# EAGLE design Street_Fighter_v1.4 (EAGLE 7.5.0)
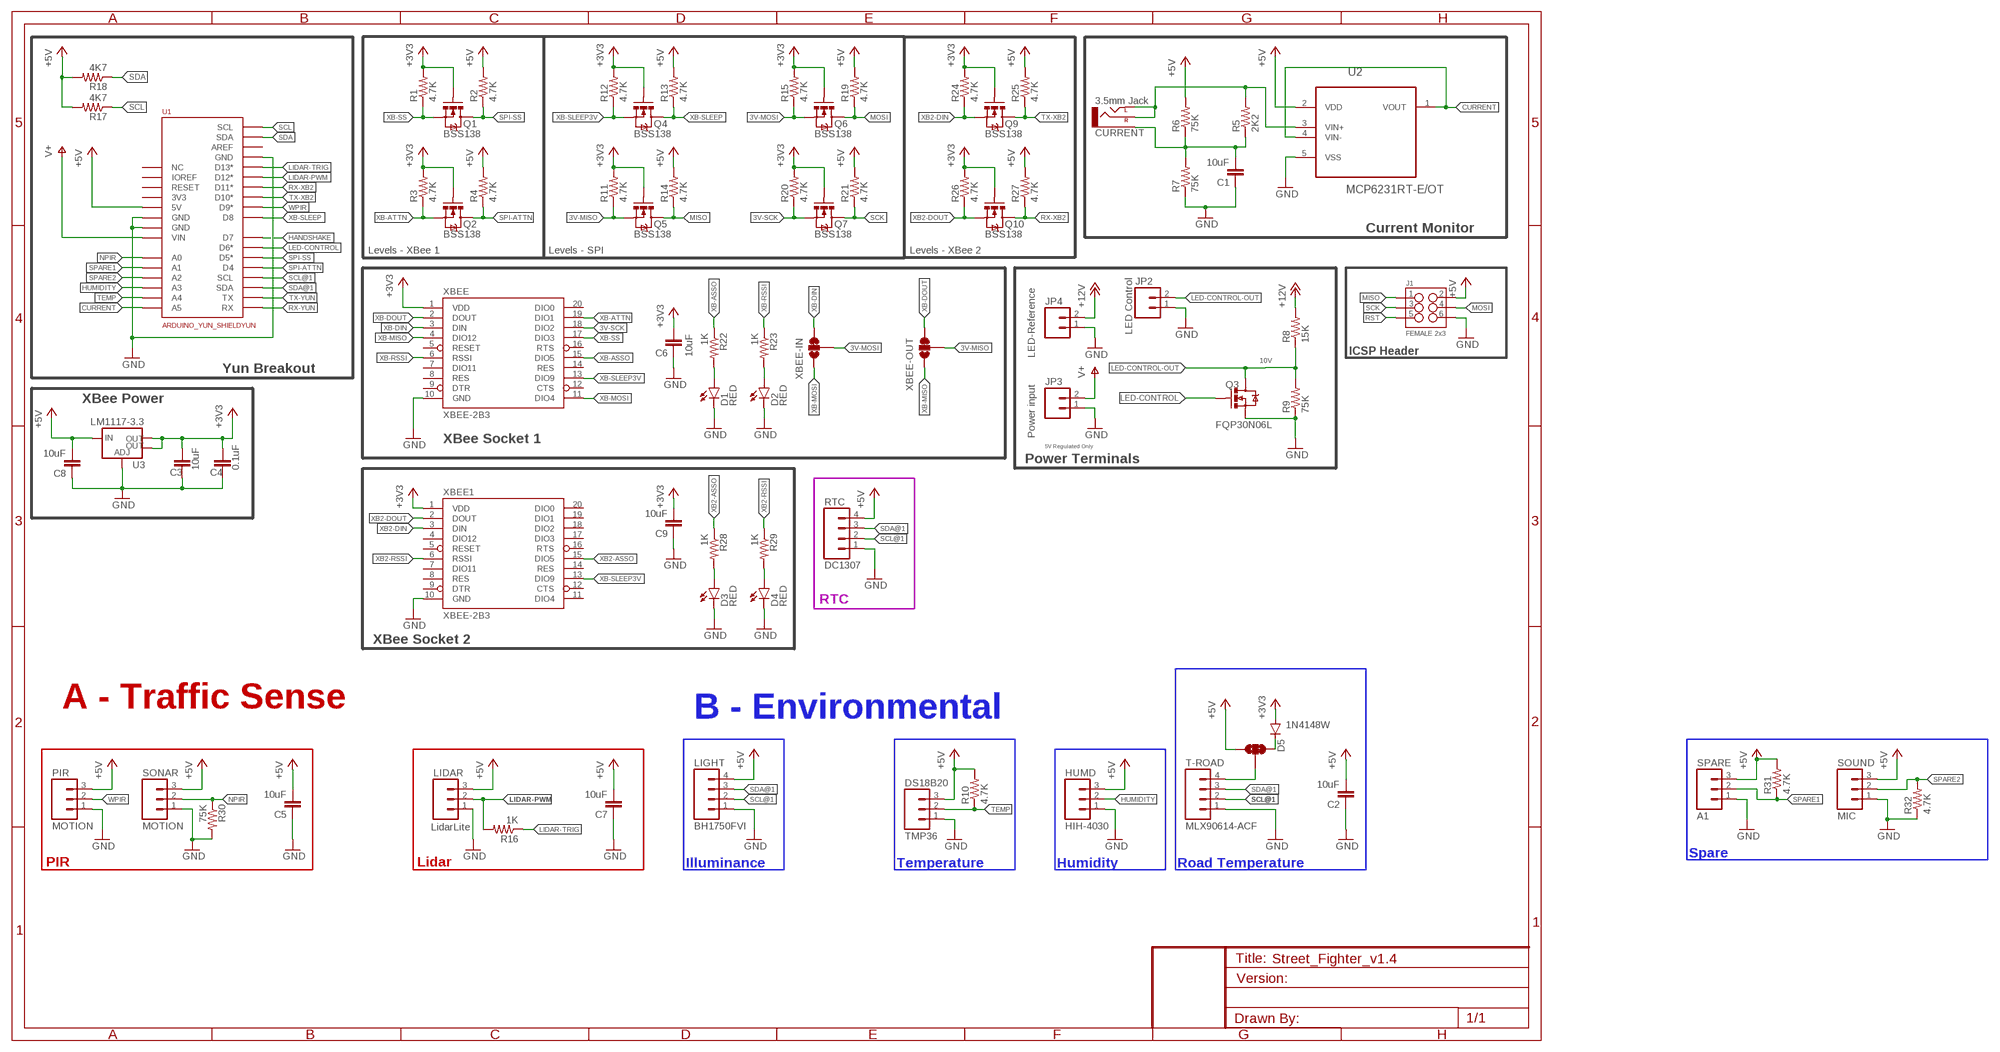
[diagram p0: schematic, sheet 1]

## Parts
C1  10uF  10UF-6.3V-20%(1206)  [1206]
C2  10uF  10UF-6.3V-20%(1206)  [1206]
C3  10uF  10UF-6.3V-20%(1206)  [1206]
C4  0.1uF  10UF-6.3V-20%(1206)  [1206]
C5  10uF  10UF-6.3V-20%(1206)  [1206]
C6  10uF  10UF-6.3V-20%(1206)  [1206]
C7  10uF  10UF-6.3V-20%(1206)  [1206]
C8  10uF  10UF-6.3V-20%(1206)  [1206]
C9  10uF  10UF-6.3V-20%(1206)  [1206]
CURRENT  3.5mm Jack  AUDIO-JACKPTH  [AUDIO-JACK]
D1  RED  LED-RED1206  [LED-1206]
D2  RED  LED-RED1206  [LED-1206]
D3  RED  LED-RED1206  [LED-1206]
D4  RED  LED-RED1206  [LED-1206]
D5  1N4148W  DIODESOD123  [SOD-123]
DS18B20  TMP36  M03PTH  [1X03]
HUMD  HIH-4030  M03PTH  [1X03]
J1  FEMALE 2x3  M03X2FEMALE  [2X3]
JP2  LED Control  M02PTH3  [1X02_LONGPADS]
JP3  Power input  M02PTH3  [1X02_LONGPADS]
JP4  LED-Reference  M02PTH3  [1X02_LONGPADS]
LIDAR  LidarLite  M03PTH  [1X03]
LIGHT  BH1750FVI  M04PTH  [1X04]
PIR  MOTION  M03PTH  [1X03]
Q1  BSS138  MOSFET-NCHANNELBSS123LT1G  [SOT23]
Q2  BSS138  MOSFET-NCHANNELBSS123LT1G  [SOT23]
Q3  FQP30N06L  MOSFET-NCHANNELFQP30N06L  [TO220V]
Q4  BSS138  MOSFET-NCHANNELBSS123LT1G  [SOT23]
Q5  BSS138  MOSFET-NCHANNELBSS123LT1G  [SOT23]
Q6  BSS138  MOSFET-NCHANNELBSS123LT1G  [SOT23]
Q7  BSS138  MOSFET-NCHANNELBSS123LT1G  [SOT23]
Q9  BSS138  MOSFET-NCHANNELBSS123LT1G  [SOT23]
Q10  BSS138  MOSFET-NCHANNELBSS123LT1G  [SOT23]
R1  4.7K  RESISTOR1206  [1206]
R2  4.7K  RESISTOR1206  [1206]
R3  4.7K  RESISTOR1206  [1206]
R4  4.7K  RESISTOR1206  [1206]
R5  2K2  RESISTOR1206  [1206]
R6  75K  RESISTOR1206  [1206]
R7  75K  RESISTOR1206  [1206]
R8  15K  RESISTOR1206  [1206]
R9  75K  RESISTOR1206  [1206]
R10  4.7K  RESISTOR1206  [1206]
R11  4.7K  RESISTOR1206  [1206]
R12  4.7K  RESISTOR1206  [1206]
R13  4.7K  RESISTOR1206  [1206]
R14  4.7K  RESISTOR1206  [1206]
R15  4.7K  RESISTOR1206  [1206]
R16  1K  RESISTOR1206  [1206]
R17  4K7  RESISTOR1206  [1206]
R18  4K7  RESISTOR1206  [1206]
R19  4.7K  RESISTOR1206  [1206]
R20  4.7K  RESISTOR1206  [1206]
R21  4.7K  RESISTOR1206  [1206]
R22  1K  RESISTOR1206  [1206]
R23  1K  RESISTOR1206  [1206]
R24  4.7K  RESISTOR1206  [1206]
R25  4.7K  RESISTOR1206  [1206]
R26  4.7K  RESISTOR1206  [1206]
R27  4.7K  RESISTOR1206  [1206]
R28  1K  RESISTOR1206  [1206]
R29  1K  RESISTOR1206  [1206]
R30  75K  RESISTOR1206  [1206]
R31  4.7K  RESISTOR1206  [1206]
R32  4.7K  RESISTOR1206  [1206]
RTC  DC1307  M04PTH  [1X04]
SONAR  MOTION  M03PTH  [1X03]
SOUND  MIC  M03PTH  [1X03]
SPARE  A1  M03PTH  [1X03]
T-ROAD  MLX90614-ACF  M04PTH  [1X04]
U1  ARDUINO_YUN_SHIELDYUN  [DUEMILANOVE_VIAS]
U2  MCP6231RT-E/OT  [SOT95P270X145-5N]
U3  LM1117-3.3  V_REG_LM1117SOT223  [SOT223]
XBEE  XBEE-2B3  [XBEE-SMD]
XBEE1  XBEE-2B3  [XBEE-SMD]
XBEE-IN  JUMPER-PAD-3-2OF3_NC_BY_TRACE_SMALL  [PAD-JUMPER-3-2OF3_NC_BY_TRACE_YES_SILK_FULL_BOX]
XBEE-OUT  JUMPER-PAD-3-2OF3_NC_BY_TRACE_SMALL  [PAD-JUMPER-3-2OF3_NC_BY_TRACE_YES_SILK_FULL_BOX]
XBEE-OUT1  JUMPER-PAD-3-2OF3_NC_BY_TRACE_SMALL  [PAD-JUMPER-3-2OF3_NC_BY_TRACE_YES_SILK_FULL_BOX]

## Nets
3V-MISO: Q5.2(S) R11.1 XBEE-OUT.2
3V-MOSI: Q6.2(S) R15.1 XBEE-IN.2
3V-SCK: Q7.2(S) R20.1 XBEE.18(DIO2)
+3V3: C3.2 C4.2 C6.2 C9.2 D5.A Q1.1(G) Q2.1(G) Q4.1(G) Q5.1(G) Q6.1(G) Q7.1(G) Q9.1(G) Q10.1(G) R1.2 R3.2 R11.2 R12.2 R15.2 R20.2 R24.2 R26.2 U3.2(OUT) U3.4(OUT) XBEE1.1(VDD) XBEE.1(VDD)
+5V: C2.2 C5.2 C7.2 C8.2 DS18B20.3 HUMD.3 J1.2 LIDAR.3 LIGHT.4 PIR.3 R2.2 R4.2 R6.2 R10.2 R13.2 R14.2 R17.2 R18.2 R19.2 R21.2 R25.2 R27.2 R31.2 RTC.4 SONAR.3 SOUND.3 SPARE.3 U1.5V U2.2(VDD) U3.3(IN) XBEE-OUT1.1
+12V: JP4.2 R8.2
CURRENT: U1.A5 U2.1(VOUT) U2.4(VIN-)
GND: C1.1 C2.1 C3.1 C4.1 C5.1 C6.1 C7.1 C8.1 C9.1 D1.C D2.C D3.C D4.C DS18B20.1 HUMD.1 J1.6 JP2.1 JP3.1 JP4.1 LIDAR.1 LIGHT.1 PIR.1 Q3.3(S) R7.1 R9.1 R30.2 R32.1 RTC.1 SONAR.1 SOUND.1 SPARE.1 T-ROAD.1 U1.GND U1.GND@0(GND) U1.GND@1(GND) U2.5(VSS) U3.1(ADJ) XBEE1.10(GND) XBEE.10(GND)
HANDSHAKE: U1.7(D7)
HUMIDITY: HUMD.2 U1.A3
LED-CONTROL: Q3.1(G) U1.6(D6*)
LED-CONTROL-OUT: JP2.2 Q3.2(D) R8.1 R9.2
LIDAR-PWM: LIDAR.2 R16.2 U1.12(D12*)
LIDAR-TRIG: R16.1 U1.13(D13*)
MISO: J1.1 Q5.3(D) R14.1
MOSI: J1.4 Q6.3(D) R19.1
N$1: D1.A R22.2
N$2: CURRENT.RING(RIGHT) CURRENT.TIP(LEFT) R5.2 U2.3(VIN+)
N$3: D2.A R23.2
N$4: C1.2 CURRENT.SLEEVE R5.1 R6.1 R7.2
N$5: D3.A R28.2
N$6: D4.A R29.2
N$7: D5.C XBEE-OUT1.3
N$8: T-ROAD.4 XBEE-OUT1.2
NPIR: R30.1 SONAR.2 U1.A0
RST: J1.5
RX-XB2: Q10.3(D) R27.1 U1.11(D11*)
RX-YUN: U1.0(RX)
SCK: J1.3 Q7.3(D) R21.1
SCL: R17.1 U1.3@1(SCL)
SCL@1: LIGHT.2 RTC.2 T-ROAD.2 U1.3(SCL)
SDA: R18.1 U1.2@1(SDA)
SDA@1: LIGHT.3 RTC.3 T-ROAD.3 U1.2(SDA)
SPARE1: R31.1 SPARE.2 U1.A1
SPARE2: R32.2 SOUND.2 U1.A2
SPI-ATTN: Q2.3(D) R4.1 U1.D4
SPI-SS: Q1.3(D) R2.1 U1.5(D5*)
TEMP: DS18B20.2 R10.1 U1.A4
TX-XB2: Q9.3(D) R25.1 U1.10(D10*)
TX-YUN: U1.1(TX)
V+: JP3.2 U1.VIN
WPIR: PIR.2 U1.9(D9*)
XB2-ASSO: R28.1 XBEE1.15(DIO5)
XB2-DIN: Q9.2(S) R24.1 XBEE1.3(DIN)
XB2-DOUT: Q10.2(S) R26.1 XBEE1.2(DOUT)
XB2-RSSI: R29.1 XBEE1.6(RSSI)
XB-ASSO: R22.1 XBEE.15(DIO5)
XB-ATTN: Q2.2(S) R3.1 XBEE.19(DIO1)
XB-DIN: XBEE-IN.3 XBEE.3(DIN)
XB-DOUT: XBEE-OUT.3 XBEE.2(DOUT)
XB-MISO: XBEE-OUT.1 XBEE.4(DIO12)
XB-MOSI: XBEE-IN.1 XBEE.11(DIO4)
XB-RSSI: R23.1 XBEE.6(RSSI)
XB-SLEEP: Q4.3(D) R13.1 U1.8(D8)
XB-SLEEP3V: Q4.2(S) R12.1 XBEE1.13(DIO9) XBEE.13(DIO9)
XB-SS: Q1.2(S) R1.1 XBEE.17(DIO3)
Unconnected: U1.AREF U1.IOREF U1.NC U1.RESET XBEE1.4(DIO12) XBEE1.5(RESET) XBEE1.7(DIO11) XBEE1.8(RES) XBEE1.9(DTR) XBEE1.11(DIO4) XBEE1.12(CTS) XBEE1.14(RES) XBEE1.16(RTS) XBEE1.17(DIO3) XBEE1.18(DIO2) XBEE1.19(DIO1) XBEE1.20(DIO0) XBEE.5(RESET) XBEE.7(DIO11) XBEE.8(RES) XBEE.9(DTR) XBEE.12(CTS) XBEE.14(RES) XBEE.16(RTS) XBEE.20(DIO0)

## Notes on the sheet
- Current Monitor
- Levels - XBee 1 | Levels - SPI | Levels - XBee 2
- ICSP Header
- 10V
- Yun Breakout
- XBee Power
- XBee Socket 1
- 5V Regulated Only
- Power Terminals
- RTC
- XBee Socket 2
- A - Traffic Sense | B - Environmental
- Spare
- PIR | Lidar | Illuminance | Temperature | Humidity | Road Temperature

## Power pins joined to a net without a drawn wire
3V3: U1.3V3

## Library data of the parts
C1-C3 C5-C9 = SparkFun-Capacitors:10UF-6.3V-20%(1206): Ceramic CAP-10057; PROD_ID: CAP-10057
C4 = SparkFun-Capacitors:10UF-6.3V-20%(1206): Ceramic CAP-10057; PROD_ID: CAP-10057; VALUE: 10uF
CURRENT = SparkFun-Connectors:AUDIO-JACK: 3.5mm Audio Jack Simple 3.5mm common PCB mount audio jack. SKU: PRT-08032
D1-D4 = SparkFun-LED:LED-RED: Assorted Red LEDs LilyPad 1206- DIO-09912 1206- DIO-00809 0603- DIO-00819 "SMART" means more efficient and expensive; PROD_ID: DIO-09912
D5 = SparkFun-DiscreteSemi:DIODE: Diode These are standard reverse protection diodes and small signal diodes. SMA package can handle up to about 1A. SOD-323 can handle about 200mA. What the SOD-323 package when ordering, there are some mfgs out there that are 5-pin packages.
DS18B20 HUMD LIDAR PIR SONAR SOUND SPARE = SparkFun-Connectors:M03: Header 3 Standard 3-pin 0.1" header. Use with straight break away headers (SKU : PRT-00116), right angle break away headers (PRT-00553), swiss pins (PRT-00743), machine pins (PRT-00117), and female headers (PRT-00115). Molex polarized connector foot print use with SKU : PRT-08232 with associated crimp pins and housings.
J1 = SparkFun-Connectors:M03X2: 2x3 .1" header. Shrouded, with keying- CONN-10681 SMT- CONN-11415 Pogo pins- HW-11044; PROD_ID: CONN-11566
JP2-JP4 = SparkFun-Connectors:M02: Header 2 Standard 2-pin 0.1" header. Use with straight break away headers (SKU : PRT-00116), right angle break away headers (PRT-00553), swiss pins (PRT-00743), machine pins (PRT-00117), and female headers (PRT-00115). Molex polarized connector foot print use with SKU : PRT-08233 with associated crimp pins and housings.
LIGHT RTC T-ROAD = SparkFun-Connectors:M04: Header 4 Standard 4-pin 0.1" header. Use with straight break away headers (SKU : PRT-00116), right angle break away headers (PRT-00553), swiss pins (PRT-00743), machine pins (PRT-00117), and female headers (PRT-00115). Molex polarized connector foot print use with SKU : PRT-08231 with associated crimp pins and housings. 1MM SMD Version SKU: PRT-10208
Q1 Q2 Q4-Q7 Q9 Q10 = SparkFun-DiscreteSemi:MOSFET-NCHANNEL: Common NMOSFET Parts MFG P/N Store ID Prod ID FDD8780 TRANS-09984 SI7820DN TRANS-11055 FDS6630A IC-08089 2N7002PW TRANS-11151 FQP30N06L COM-10213 TRANS-10060 BSS123LT1G TRANS-08345 BSS138 TRANS-00830 BS170 2N7000; PROD_ID: TRANS-08345
Q3 = SparkFun-DiscreteSemi:MOSFET-NCHANNEL: Common NMOSFET Parts MFG P/N Store ID Prod ID FDD8780 TRANS-09984 SI7820DN TRANS-11055 FDS6630A IC-08089 2N7002PW TRANS-11151 FQP30N06L COM-10213 TRANS-10060 BSS123LT1G TRANS-08345 BSS138 TRANS-00830 BS170 2N7000; PROD_ID: TRANS-10060
R1-R32 = SparkFun-Passives:RESISTOR: Resistor Basic schematic elements and footprints for 0603, 1206, and PTH resistors.
U1 = SparkFun-Boards:ARDUINO_YUN_SHIELD
U2 = Microchip_By_element14_Batch_1:MCP6231RT-E/OT: 20 µA, 300 kHz Rail-to-Rail Op Amp; DESCRIPTION: OP AMP; MPN: MCP6231RT-E/OT; OC_FARNELL: 1840878; OC_NEWARK: 84R5186; PACKAGE: SOT-5; SUPPLIER: Microchip
U3 = SparkFun-PowerIC:V_REG_LM1117: Voltage Regulator LM1117 Standard adjustable voltage regulator but in SMD form. Spark Fun Electronics SKU : COM-00595; PROD_ID: VREG-08170
XBEE XBEE1 = SparkFun-RF:XBEE-2: Xbee module footprints SMT header is CONN-09042.; PROD_ID: CONN-09042
XBEE-IN XBEE-OUT XBEE-OUT1 = SparkFun-Passives:JUMPER-PAD-3-2OF3_NC_BY_TRACE

## Board
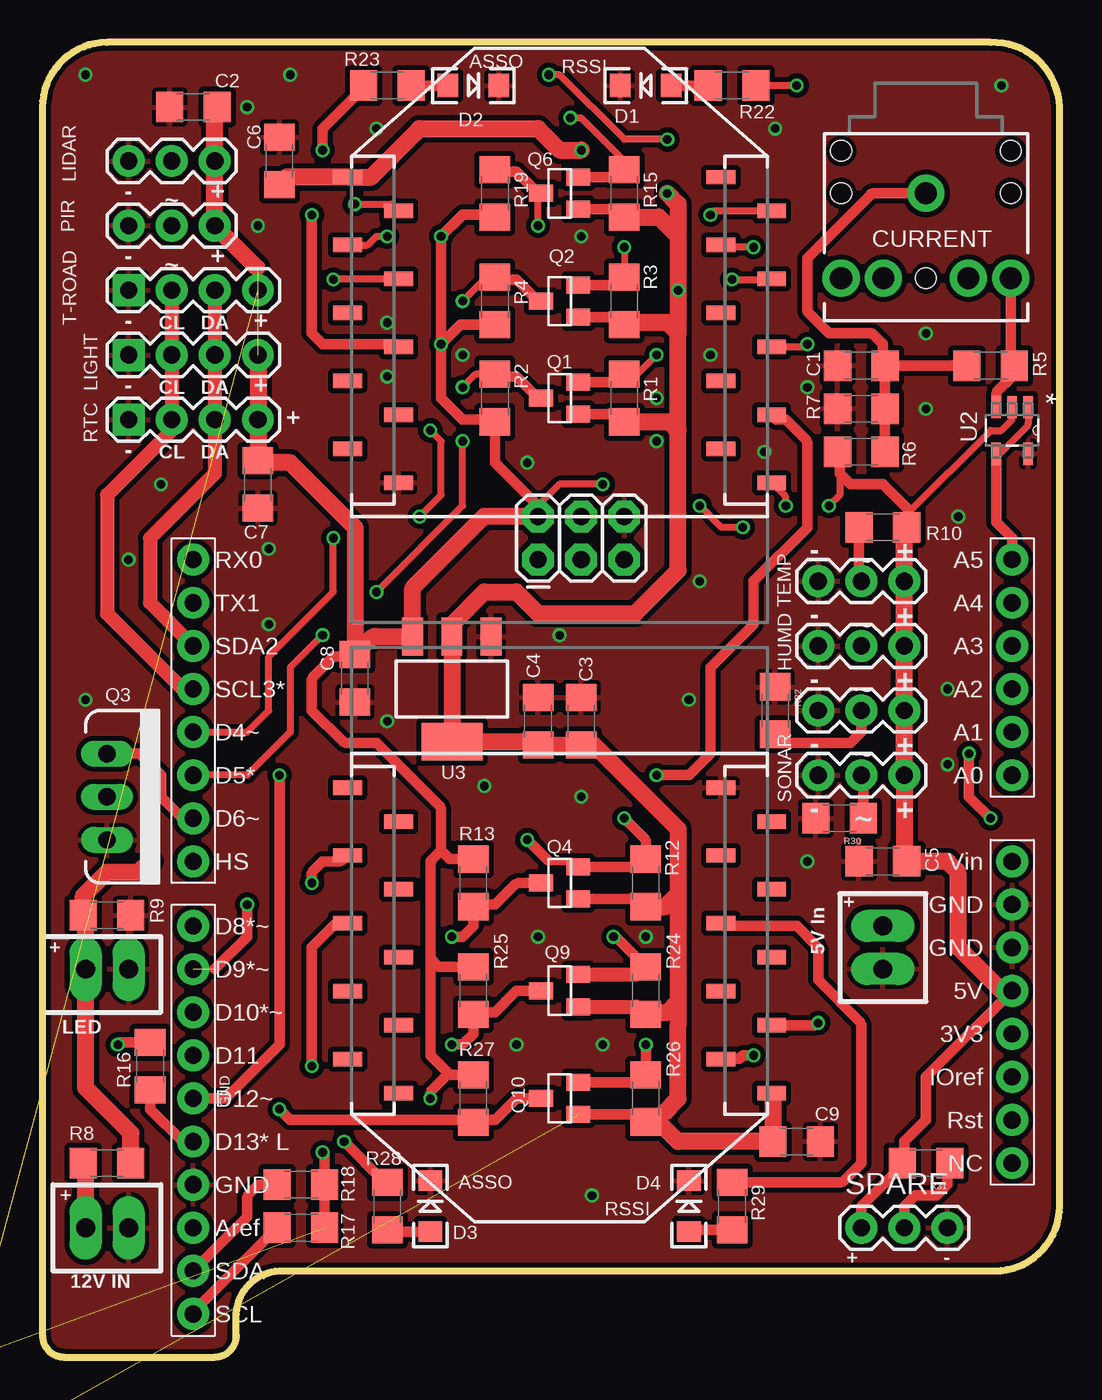
[diagram p1: board, top side]
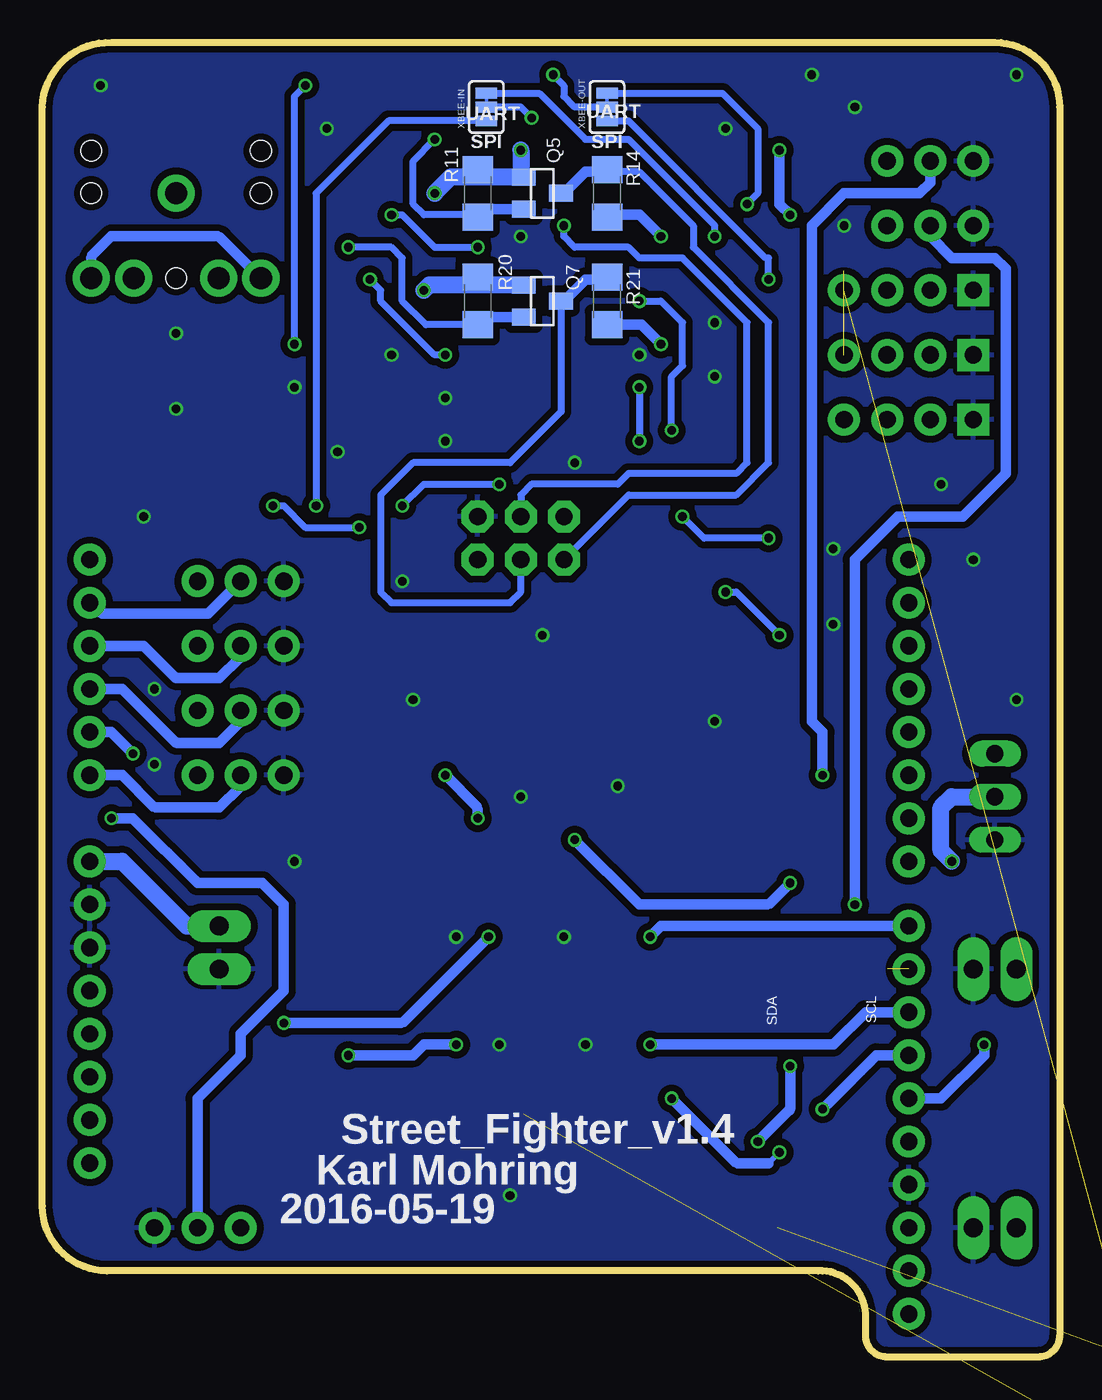
[diagram p2: board, bottom side, seen from below]

Size 59.94 x 77.47 mm. Coordinates in mm from the lower left corner, seen from the top.
Outline: 10.16,0 arc90 11.43,1.27 11.43,2.54 arc-90 14.22,5.08 56.13,5.08 arc90 59.94,8.89 59.94,73.66 arc90 55.88,77.47 3.81,77.47 arc90 0,73.66 0,1.27 arc90 1.27,0 10.16,0
Copper layers (1*16): Top 0.035mm / dielectric 1.5mm / Bottom 0.035mm
Design rules "ITEADstudio_DRC": minimum track width 6mil, minimum drill 12mil, track to track 6mil, track to pad 6mil, pad to pad 6mil, via to via 6mil, smd to smd 0mil, copper to edge 10mil, drill to drill 10mil, minimum pad ring 10mil, minimum via ring 6mil, stop-mask expansion 2mil, vias tented up to drill 100mil, thermal gap 10mil

### Footprints (pad centres in the part's own frame; a part is rotated, then mirrored left to right if it is on the bottom)
1206 = smd 1.6 x 1.8: 1 -1.4,0; 2 1.4,0
AUDIO-JACK = drill 1.3 pad 2.184: RING 5,5; RSH 5,2.5; SLEEVE 0,0; TIP 5,-5; TSH 5,-2.5 | hole 1.2: 0,5; -2.5,5; -2.5,-5; 0,-5; 5,0
LED-1206 = smd 1.2 x 1.4: A -1.5,0; C 1.5,0
SOD-123 = smd 0.9 x 0.95: A 1.575,0; C -1.575,0
1X03 = drill 1.016 pad 1.88: 1 0,0; 2 2.54,0; 3 5.08,0
2X3 = drill 1.016 pad 1.88 octagon: 1 0,0; 2 0,2.54; 3 2.54,0; 4 2.54,2.54; 5 5.08,0; 6 5.08,2.54
1X02_LONGPADS = drill 1.118 pad 1.88 long: 1 0,0; 2 2.54,0
1X04 = drill 1.016 pad 1.88 square: 1 0,0 | drill 1.016 pad 1.88: 2 2.54,0; 3 5.08,0; 4 7.62,0
SOT23 = smd 1 x 1.4: 1 -0.95,-1.1; 2 0.95,-1.1; 3 0,1.1
TO220V = drill 1.016 long: 1 -2.54,0; 2 0,0; 3 2.54,0
DUEMILANOVE_VIAS = drill 1.016 pad 1.88: 0 2.54,41.91; 1 2.54,39.37; 2 2.54,36.83; 2@1 2.54,0; 3 2.54,34.29; 3@1 2.54,-2.54; 3V3 50.8,13.97; 5 2.54,29.21; 5V 50.8,16.51; 6 2.54,26.67; 7 2.54,24.13; 8 2.54,20.32; 9 2.54,17.78; 10 2.54,15.24; 11 2.54,12.7; 12 2.54,10.16; 13 2.54,7.62; A0 50.8,29.21; A1 50.8,31.75; A2 50.8,34.29; A3 50.8,36.83; A4 50.8,39.37; A5 50.8,41.91; AREF 2.54,2.54; D4 2.54,31.75; GND 2.54,5.08; GND@0 50.8,19.05; GND@1 50.8,21.59; IOREF 50.8,11.43; NC 50.8,6.35; RESET 50.8,8.89; VIN 50.8,24.13
SOT95P270X145-5N = smd 1.321 x 0.559: 1 -1.372,0.94; 2 -1.372,0; 3 -1.372,-0.94; 4 1.372,-0.94; 5 1.372,0.94
SOT223 = smd 1.219 x 2.235: 1 -2.311,-3.099; 2 0,-3.099; 3 2.311,-3.099 | smd 3.6 x 2.2: 4 0,3.099
XBEE-SMD = smd 1.7 x 0.85: 1 -12.5,20; 2 -9.5,18; 3 -12.5,16; 4 -9.5,14; 5 -12.5,12; 6 -9.5,10; 7 -12.5,8; 8 -9.5,6; 9 -12.5,4; 10 -9.5,2; 11 12.5,2; 12 9.5,4; 13 12.5,6; 14 9.5,8; 15 12.5,10; 16 9.5,12; 17 12.5,14; 18 9.5,16; 19 12.5,18; 20 9.5,20
PAD-JUMPER-3-2OF3_NC_BY_TRACE_YES_SILK_FULL_BOX = smd 0.635 x 1.27: 1 -0.813,0; 2 0,0; 3 0.813,0

### Placement (x,y rotation side)
C1  48.26,58.42 0 top
C2  8.89,73.66 0 top
C3  31.75,37.47 270 top
C4  29.21,37.47 270 top
C5  49.53,29.21 0 top
C6  13.97,70.48 270 top
C7  12.7,51.44 90 top
C8  18.41,40.01 90 top
C9  44.45,12.7 180 top
CURRENT  52.07,68.58 270 top
D1  35.56,74.93 180 top
D2  25.4,74.93 0 top
D3  22.86,8.89 90 top
D4  38.1,8.89 90 top
D5  -4.45,-5.08 0 top  (outside the outline)
DS18B20  45.72,45.72 0 top
HUMD  45.72,41.91 0 top
J1  29.21,46.99 0 top
JP2  5.08,22.86 180 top
JP3  49.53,22.86 90 top
JP4  5.08,7.62 180 top
LIDAR  5.08,70.48 0 top
LIGHT  5.08,59.05 0 top
PIR  5.08,66.67 0 top
Q1  30.48,56.52 90 top
Q2  30.48,62.23 90 top
Q3  3.81,33.02 270 top
Q4  30.48,27.94 90 top
Q5  30.48,68.58 270 bottom
Q6  30.48,68.58 90 top
Q7  30.48,62.23 270 bottom
Q9  30.48,21.59 90 top
Q10  30.48,15.24 90 top
R1  34.29,56.52 270 top
R2  26.67,56.52 270 top
R3  34.29,62.23 270 top
R4  26.67,62.23 270 top
R5  55.88,58.42 0 top
R6  48.26,53.34 180 top
R7  48.26,55.88 0 top
R8  3.81,11.43 180 top
R9  3.81,26.04 180 top
R10  49.53,48.9 0 top
R11  34.29,68.58 90 bottom
R12  35.56,27.94 270 top
R13  25.4,27.94 90 top
R14  26.67,68.58 270 bottom
R15  34.29,68.58 270 top
R16  6.35,17.14 90 top
R17  15.24,7.62 0 top
R18  15.24,10.16 0 top
R19  26.67,68.58 270 top
R20  34.29,62.23 90 bottom
R21  26.67,62.23 270 bottom
R22  40.64,74.93 180 top
R23  20.32,74.93 0 top
R24  35.56,21.59 270 top
R25  25.4,21.59 90 top
R26  35.56,15.24 270 top
R27  25.4,15.24 90 top
R28  20.32,8.89 270 top
R29  40.64,8.89 270 top
R30  46.99,31.75 180 top
R31  52.07,11.43 180 top
R32  43.18,38.1 270 top
RTC  5.08,55.24 0 top
SONAR  45.72,34.29 0 top
SOUND  45.72,38.1 0 top
SPARE  53.34,7.62 180 top
T-ROAD  5.08,62.87 0 top
U1  6.35,5.08 0 top
U2  57.15,54.61 270 top
U3  24.13,39.37 180 top
XBEE  30.48,49.53 0 top
XBEE1  30.48,35.56 180 top
XBEE-IN  33.78,73.66 90 bottom
XBEE-OUT  26.67,73.66 90 bottom
XBEE-OUT1  -5.08,-0.64 0 top  (outside the outline)

### Tracks (layer width: path | path; a pad name or v marks a point on that pad's centre or on a via)
3V-MISO  (via drill 0.51)
  Top 0.406: v36.83,71.75 34.29,71.75 30.48,75.56 v29.84,75.56
  Bottom 0.406: XBEE-OUT.2 28.57,73.66 29.21,74.3 29.21,74.93 v29.84,75.56 | Q5.2 34.6,67.63 34.92,67.31 37.47,67.31 38.1,67.94 38.1,70.48 v36.83,71.75
  Bottom 0.61: Q5.2 33.84,67.63 R11.1
3V-MOSI  (via drill 0.51)
  Top 0.406: R15.1 34.29,70.48 31.75,73.03 v31.11,73.03
  Top 0.61: Q6.2 33.84,69.53 R15.1
  Bottom 0.406: XBEE-IN.2 31.75,73.66 v31.11,73.03
3V-SCK  (via drill 0.51)
  Top 0.406: v41.91,65.41 40.1,65.41 XBEE.18
  Bottom 0.406: R20.1 37.34,60.83 38.73,62.23 38.73,64.77 39.37,65.41 v41.91,65.41
  Bottom 0.61: Q7.2 33.84,61.28 R20.1
+3V3  (via drill 0.51)  (1 unrouted)
  Top 0.305: 35.01,26.99 arc-45 35.18,26.92 R12.2 | 35.01,20.64 arc-45 35.18,20.57 R24.2 35.62,20.25 arc-45 35.8,20.32 | 35.01,14.29 arc-45 35.18,14.22 R26.2 | 28.9,36.27 arc-45 29.08,36.2 C4.2 | XBEE1.1 arc-45 43.05,15.39 | 36.4,13.77 arc45 36.22,13.84 | 36.41,14.29 arc45 36.59,14.36 | 37.39,24.71 arc-45 37.47,24.53
  Top 0.61: Q4.1 35.01,26.99 | Q10.1 35.01,14.29 | C3.2 32.52,36.06 | Q1.1 33.84,55.56 R1.2 | 34.42,60.96 R3.2 33.84,61.28 Q2.1 | Q6.1 33.84,67.63 R15.2 | U3.2 24.13,43.18
  Top 0.813: Q9.1 35.01,20.64 | 36.22,13.84 R26.2 | 35.01,14.29 36.41,14.29 | 37.47,19.58 arc45 37.39,19.76
  Top 1.016: U3.2 U3.4 28.9,36.27 | C4.2 C3.2 | 43.05,15.39 C9.2 37.47,12.7 36.4,13.77 | 36.59,14.36 37.47,15.24 37.47,19.58 37.47,20.95 | 37.47,20.95 37.47,24.53 37.47,27.3 | 32.52,36.06 37.47,31.11 37.47,27.3 | C6.2 14.41,69.53 XBEE.1 19.36,69.53 22.23,72.39 29.21,72.39 30.48,71.12 v31.75,71.12 | 35.8,20.32 36.83,20.32 37.47,20.95 | R12.2 36.7,26.54 37.47,27.3 | R1.2 36.96,55.12 37.47,54.61 | 37.47,60.33 36.83,60.96 34.42,60.96 | 37.47,60.33 v37.47,62.87 37.47,66.04 | R15.2 36.33,67.18 37.47,66.04 | v36.83,68.58 37.47,67.94 37.47,66.04 | 24.13,43.18 26.04,45.09 27.94,45.09 29.21,43.81 34.92,43.81 37.47,46.35 37.47,54.61 | 37.47,54.61 37.47,60.33
  Bottom 0.61: Q7.1 33.84,63.18 R20.2 | R11.2 33.84,69.53 Q5.1 31.75,69.7
  Bottom 1.016: Q7.1 37.15,63.18 v37.47,62.87 | Q5.1 35.88,69.53 v36.83,68.58 | v31.75,71.12 31.75,69.7
+5V  (via drill 0.51)  (2 unrouted)
  Top 0.305: 10.23,73.6 C2.2 | 12.7,64.03 arc45 12.63,64.21 | RTC.4 12.7,52.94 arc45 12.77,52.76 C7.2 | 19.58,42.47 arc45 19.4,42.39 | 56.62,21.59 arc-45 56.44,21.66 | 53.98,28.47 arc45 53.9,28.65 | 50.8,48.66 arc-45 50.87,48.84 R10.2 50.93,49.55 arc-45 51,49.73 | 23.5,32.28 arc45 23.42,32.46 | 17.89,36.2 arc-45 17.71,36.27 | 15.88,39.9 arc-45 15.95,40.08 | 18.36,41.35 C8.2 | 24.11,16.64 arc-45 23.93,16.71 | 22.93,15.72 arc45 22.86,15.54 | 16.57,12.01 arc-45 16.64,11.83
  Top 0.406: 51,49.73 55.88,54.61 56.52,54.61 57.15,55.24 U2.2 | 46.99,52.07 46.99,50.8 v46.35,50.16 | v41.27,48.9 40.01,48.9 v38.73,50.16 | v33.02,51.44 30.48,51.44 29.21,50.16 | 26.04,67.31 26.67,67.31
  Top 0.61: R13.2 24.11,29.34 arc-45 23.93,29.41 23.5,29.84 | 23.5,29.84 23.5,32.28 | 23.42,32.46 19.68,36.2 17.89,36.2 | 17.71,36.27 15.88,38.1 15.88,39.9 | 15.95,40.08 17.14,41.27 18.18,41.27 | R25.2 23.47,22.99 arc-45 23.29,23.06 22.86,23.5 | 22.86,23.5 22.86,29.11 arc-45 22.93,29.28 23.5,29.84 | R27.2 24.11,16.64 | 22.86,23.5 22.86,17.78 23.93,16.71 22.93,15.72 | 22.86,15.54 v22.86,15.24 | v16.51,12.06 16.57,12.01 | 16.64,11.83 R18.2 R17.2 | SPARE.3 48.26,8.89 50.67,11.3 R31.2 50.8,11.56 50.8,12.7 52.07,13.97 52.07,16.51 U1.5V | R19.2 26.54,67.31 26.04,67.31 24.77,67.31 v23.5,66.04 | v23.5,59.69 v23.5,66.04 | R21.2 24.64,60.83 v23.5,59.69 | 51,49.73 51,49.96 49.53,51.44 47.62,51.44 46.99,52.07 46.99,53.21 R6.2 | J1.2 29.21,50.16 26.67,52.7 R2.2 26.54,55.24 24.77,55.24 23.5,56.52 v23.5,59.69 | 24.64,67.18 v23.5,66.04
  Top 1.016: 10.23,73.6 arc45 10.16,73.42 LIDAR.3 PIR.3 12.63,64.21 | LIGHT.4 RTC.4 C7.2 | C7.2 12.7,52.7 | 19.4,42.39 C8.2 18.41,48.9 14.61,52.7 12.83,52.7 C7.2 | U1.5V 56.62,21.59 | 56.44,21.66 53.98,24.13 53.98,28.47 | 53.9,28.65 53.34,29.21 C5.2 50.8,29.34 SONAR.3 SOUND.3 HUMD.3 DS18B20.3 50.8,48.66 | 18.18,41.27 arc45 18.36,41.35 | 19.58,42.47 U3.3 21.82,45.31 26.04,49.53 J1.2 27.94,49.53
  Bottom 0.305: 19.12,11.5 arc-45 18.95,11.43 | 17.14,11.43 v16.51,12.06
  Bottom 0.406: v46.35,50.16 45.72,50.16 44.45,48.9 v41.27,48.9 | v38.73,50.16 37.47,51.44 v33.02,51.44
  Bottom 0.61: v22.86,15.24 19.12,11.5 | 18.95,11.43 17.14,11.43 | R21.2 24.64,60.83 v23.5,59.69 | v23.5,66.04 24.77,67.31 26.54,67.31 R19.2
+12V
  Top 1.016: JP4.2 2.54,11.3 R8.2
CURRENT
  Top 0.305: U2.4 56.31,53.24
  Top 0.406: U2.1 58.09,55.02 arc-45 58.02,54.84 56.49,53.31 arc-45 56.31,53.24
  Top 0.61: U2.4 56.21,49.2 57.15,48.26 U1.A5
GND  (via drill 0.51)
  other vias: 2.54,38.73 6.99,51.44 2.54,75.56 14.61,75.56 28.57,52.7 38.73,45.72 45.09,57.15 52.07,60.33 52.07,55.88 53.98,49.53 53.34,39.37 53.34,34.92 27.94,18.41 29.21,24.77 31.75,33.02 26.04,33.66 33.02,18.41 5.08,46.99 19.68,72.39 43.18,72.39 20.32,60.96 20.32,37.47 12.7,66.67 12.06,73.66 45.09,29.21 32.38,9.53 56.52,74.93 35.56,24.77 20.32,57.78 30.48,42.55 38.1,38.73 13.34,47.62 13.34,43.18 24.77,59.05 36.2,53.98 36.2,56.52 39.37,59.05 42.55,53.34 31.75,66.04
  pour Top (isolate 0.305): -3.17,81.92 62.87,81.92 62.87,-3.17 -3.17,-3.17
  pour Bottom (isolate 0.406): -2.54,80.64 61.59,80.64 61.59,-1.91 -2.54,-1.91
HUMIDITY
  Bottom 0.305: 48.26,41.38 arc45 48.33,41.2
  Bottom 0.61: HUMD.2 48.26,41.38 | 48.33,41.2 49.53,40.01 51.97,40.01 arc45 52.14,40.08 53.98,41.91 U1.A3
LED-CONTROL
  Top 0.61: Q3.1 5.71,35.56 6.99,34.29 6.99,33.02 8.26,31.75 U1.6
LED-CONTROL-OUT  (via drill 0.51)
  Top 1.016: R8.1 5.21,13.21 2.54,15.88 JP2.2 2.54,25.91 R9.2 2.41,27.18 3.81,28.57 5.71,28.57 v6.35,29.21
  Bottom 1.016: v6.35,29.21 6.99,29.84 6.99,32.38 6.35,33.02 Q3.2
LIDAR-PWM  (via drill 0.51)
  Top 0.61: v13.97,34.29 13.97,18.41 10.79,15.24 U1.12 | R16.2 4.58,18.55 v4.45,18.41
  Bottom 0.61: v13.97,34.29 13.97,36.83 14.61,37.47 14.61,66.67 12.7,68.58 8.26,68.58 7.62,69.22 LIDAR.2 | v4.45,18.41 4.45,17.78 6.99,15.24 U1.12
LIDAR-TRIG
  Top 0.61: U1.13 8.26,12.7 6.35,14.61 R16.1
MISO
  Bottom 0.406: J1.1 28.57,46.99 28.57,47.62 25.4,50.8 19.05,50.8 17.14,52.7 17.14,60.96 21.59,65.41 21.59,66.67 24.77,69.85 26.54,69.85 R14.1
  Bottom 0.61: Q5.3 29.21,68.58 27.94,69.85 26.8,69.85 R14.1
MOSI  (via drill 0.51)
  Top 0.406: v29.21,66.67 29.21,68.41 Q6.3
  Top 0.61: R19.1 26.8,69.85 27.94,69.85 29.21,68.58 Q6.3
  Bottom 0.406: J1.4 31.75,50.8 31.11,51.44 26.04,51.44 25.4,52.07 19.05,52.07 18.41,52.7 18.41,60.96 22.23,64.77 24.77,64.77 25.4,65.41 28.57,65.41 29.21,66.04 v29.21,66.67
N$1
  Top 0.61: R22.2 D1.A
N$2
  Top 0.305: 57.07,58.73 arc45 57.14,58.56 R5.2 57.22,58.36 arc45 57.15,58.19 57.15,57.78 | 56.21,56.74 arc-45 56.28,56.92
  Top 0.61: CURRENT.RING 57.07,58.73 | U2.3 56.21,56.74 | 56.28,56.92 57.15,57.78
  Bottom 0.305: 57.07,64.75 arc45 57,64.92 | 49.63,66.04 arc45 49.46,65.97
  Bottom 0.61: CURRENT.RING 57.07,64.75 | 57,64.92 55.88,66.04 49.63,66.04 | 49.46,65.97 CURRENT.TIP
N$3
  Top 0.61: R23.2 D2.A
N$4
  Top 0.305: 49.53,58.66 arc45 49.6,58.48 C1.2 | R7.2 49.66,56.52 49.6,56.46 arc45 49.53,56.28 49.53,55.24 49.59,55.19 arc-45 49.66,55.01
  Top 0.61: CURRENT.SLEEVE 49,68.58 arc45 48.82,68.51 45.09,64.77 45.09,61.7 arc45 45.16,61.52 46.35,60.33 48.79,60.33 arc-45 48.97,60.25 49.53,59.69 49.53,58.66 | 49.66,56.52 C1.2 R5.1 | R6.1 49.66,55.01
N$5
  Top 0.305: R28.2 20.35,7.46 arc45 20.52,7.39
  Top 0.61: 20.52,7.39 D3.A
N$6
  Top 0.305: D4.A 38.13,7.42 arc-45 38.3,7.49
  Top 0.61: 38.3,7.49 R29.2
N$7  (1 unrouted)
N$8  (1 unrouted)
NPIR
  Top 0.61: R30.1 48.39,34.16 SONAR.2
  Bottom 0.305: 53.23,32.38 arc45 53.41,32.46
  Bottom 0.61: 53.23,32.38 49.53,32.38 48.33,33.58 48.33,34.22 SONAR.2 | 53.41,32.46 55.24,34.29 U1.A0
RX-XB2  (via drill 0.51)
  Top 0.305: 25.16,13.97 arc-45 25.34,13.9 R27.1 25.46,13.9 arc-45 25.64,13.97
  Top 0.61: 25.16,13.97 14.61,13.97 v13.97,14.61 | Q10.3 28.05,15.24 arc45 27.87,15.17 26.67,13.97 25.64,13.97
  Bottom 0.61: v13.97,14.61 10.79,17.78 U1.11
SCK
  Bottom 0.406: Q7.3 29.38,55.71 32.38,52.7 38.1,52.7 40.01,50.8 40.01,45.09 39.37,44.45 32.38,44.45 31.75,45.09 J1.3
  Bottom 0.61: Q7.3 29.21,62.23 27.94,63.5 26.8,63.5 R21.1
SCL
  Top 0.305: U1.3@1 8.89,2.67
  Top 0.61: 8.89,2.67 R17.1
SCL@1
  Top 0.305: U1.3 8.26,39.37
  Top 0.813: T-ROAD.2 LIGHT.2 RTC.2 7.62,54.61 3.81,50.8 3.81,43.81 8.26,39.37
SDA
  Top 0.305: 12.06,9.42 arc-45 12.14,9.6
  Top 0.61: U1.2@1 12.06,8.26 12.06,9.42 | 12.14,9.6 12.7,10.16 R18.1
SDA@1
  Top 0.813: T-ROAD.3 LIGHT.3 RTC.3 10.16,52.07 6.35,48.26 6.35,44.45 U1.2
SPARE1  (via drill 0.51)
  Top 0.61: v54.61,35.56 54.61,33.02 v55.88,31.75 | R31.1 53.34,11.3 53.34,10.16 52.7,9.53 51.44,9.53 50.8,8.89 SPARE.2
  Bottom 0.61: v54.61,35.56 55.88,36.83 U1.A1 | v55.88,31.75 54.61,31.75 50.8,27.94 46.99,27.94 45.72,26.67 45.72,21.59 48.26,19.05 48.26,17.78 50.8,15.24 SPARE.2
SPARE2
  Top 0.61: SOUND.2 48.26,36.83 47.62,36.2 43.69,36.2 R32.2
  Bottom 0.61: SOUND.2 48.26,37.57 arc45 48.33,37.39 49.53,36.2 51.97,36.2 arc45 52.14,36.27 55.24,39.37 U1.A2
SPI-ATTN  (via drill 0.51)
  Top 0.406: 26.8,63.5 26.04,63.5 v24.77,62.23 | U1.D4 12.06,36.83 13.34,38.1 13.34,41.27 17.14,45.09 v17.14,48.26 | v22.23,49.53 23.5,50.8 23.5,53.98 v22.86,54.61
  Top 0.61: Q2.3 29.21,62.23 27.94,63.5 26.8,63.5 R4.1
  Bottom 0.406: v24.77,62.23 23.5,62.23 22.23,60.96 22.23,58.42 22.86,57.78 v22.86,54.61 | v17.14,48.26 20.95,48.26 v22.23,49.53
SPI-SS  (via drill 0.51)
  Top 0.406: R2.1 25.53,57.91 v24.77,57.15 | v19.68,45.09 24.77,50.16 v24.77,53.98 | v16.51,42.55 14.61,40.64 14.61,36.83 12.06,34.29 U1.5
  Top 0.61: Q1.3 29.21,56.52 27.94,57.78 26.8,57.78 R2.1
  Bottom 0.406: v24.77,57.15 v24.77,53.98 | v19.68,45.09 19.05,45.09 v16.51,42.55
TEMP
  Top 0.305: 48.2,45.78 arc-45 48.13,45.95
  Top 0.61: DS18B20.2 48.2,45.78 | 48.13,45.95 R10.1
  Bottom 0.305: 56.41,43.81 arc45 56.59,43.89
  Bottom 0.61: DS18B20.2 50.09,43.89 arc45 50.27,43.81 56.41,43.81 | 56.59,43.89 U1.A4
TX-XB2  (via drill 0.51)
  Top 0.305: 25.64,20.32 arc45 25.46,20.25 R25.1
  Top 0.61: Q9.3 28.05,21.59 arc45 27.87,21.52 26.67,20.32 25.64,20.32 | R25.1 25.4,19.05 24.77,18.41 v24.13,18.41
  Bottom 0.61: v24.13,18.41 13.34,18.41 11.43,20.32 U1.10
V+
  Bottom 1.016: U1.VIN 55.24,29.21 51.44,25.4 JP3.2
WPIR  (via drill 0.51)  (1 unrouted)
  Top 0.61: v12.06,26.67 12.06,24.77 10.16,22.86
  Bottom 0.61: PIR.2 7.62,66.04 6.35,64.77 3.81,64.77 3.17,64.14 3.17,52.07 5.71,49.53 9.53,49.53 12.06,46.99 v12.06,26.67
XB2-ASSO  (via drill 0.51)
  Top 0.305: R28.1 20.3,10.29 | 17.23,25.49 arc-45 17.41,25.56
  Top 0.61: 20.3,10.29 arc-45 20.12,10.36 v17.78,12.7 | v15.88,17.14 15.88,24.13 17.23,25.49 | 17.41,25.56 XBEE1.15
  Bottom 0.61: v17.78,12.7 15.95,14.53 arc-45 15.88,14.71 v15.88,17.14
XB2-DIN  (via drill 0.51)
  Top 0.305: 35.01,22.54 arc45 35.18,22.61 R24.1 | 33.68,24.77 v33.66,24.77 | 45.67,19.63 arc-45 45.49,19.56
  Top 0.61: R24.1 33.86,24.69 arc45 33.68,24.77 | v45.72,19.68 45.67,19.63 | 45.49,19.56 XBEE1.3
  Top 0.813: Q9.2 35.01,22.54
  Bottom 0.305: 38.66,19.76 arc45 38.84,19.68
  Bottom 0.61: v33.66,24.77 38.66,19.76 | 38.84,19.68 v45.72,19.68
XB2-DOUT  (via drill 0.51)
  Top 0.305: 35.01,16.19 arc45 35.18,16.26 R26.1
  Top 0.61: Q10.2 35.01,16.19 | R26.1 v35.56,18.41 | XBEE1.2 41.05,17.56 41.27,17.78 v41.91,17.78
  Bottom 0.61: v35.56,18.41 37.47,18.41 38.1,17.78 41.27,17.78 v41.91,17.78
XB2-RSSI
  Top 0.305: 47.02,10.29 arc45 47.19,10.36 | 48.26,19.58 arc45 48.19,19.76 | 45.72,24.02 arc45 45.65,24.2 | 40.07,25.47 XBEE1.6
  Top 0.61: R29.1 47.02,10.29 | 47.19,10.36 48.26,11.43 48.26,19.58 | 48.19,19.76 45.72,22.23 45.72,24.02 | 45.65,24.2 44.45,25.4 40.24,25.4 arc-45 40.07,25.47
XB-ASSO  (via drill 0.51)
  Top 0.406: XBEE.15 44.92,59.53 v45.09,59.69 | v44.45,74.93 R22.1
  Bottom 0.406: v45.09,59.69 45.09,74.3 v44.45,74.93
XB-ATTN  (via drill 0.51)
  Top 0.406: XBEE.19 39.59,67.53 v39.37,67.31 | v34.29,65.41 R3.1
  Top 0.61: Q2.2 33.84,63.18 R3.1
  Bottom 0.406: v39.37,67.31 38.73,67.31 36.83,65.41 v34.29,65.41
XB-DIN  (via drill 0.51)
  Top 0.406: XBEE.3 19.18,65.53 19.68,66.04 v20.32,66.04
  Bottom 0.406: XBEE-IN.3 30.66,74.47 27.94,71.75 25.4,71.75 20.32,66.67 v20.32,66.04
XB-DOUT  (via drill 0.51)
  Top 0.406: 20.76,67.31 XBEE.2 20.57,67.94 v18.41,67.94
  Bottom 0.406: XBEE-OUT.3 19.86,74.47 17.78,72.39 17.78,68.58 v18.41,67.94
XB-MISO  (via drill 0.51)
  Top 0.406: XBEE.4 17.18,63.53 v17.14,63.5
  Bottom 0.406: v17.14,63.5 17.14,64.77 17.32,64.77 25.4,72.85 XBEE-OUT.1
XB-MOSI  (via drill 0.51)
  Top 0.406: v43.81,50.16 43.81,50.7 XBEE.11
  Bottom 0.406: XBEE-IN.1 39.55,72.85 43.81,68.58 v43.81,50.16
XB-RSSI  (via drill 0.51)
  Top 0.305: R23.1 18.92,74.8
  Top 0.61: 18.92,74.8 16.51,72.39 v16.51,71.12 | v15.88,67.31 15.88,60.33 16.51,59.69 20.82,59.69 XBEE.6
  Bottom 0.61: v16.51,71.12 16.51,67.94 v15.88,67.31
XB-SLEEP  (via drill 0.51)
  Top 0.305: 28.05,27.94 arc45 27.87,27.87 | 25.64,26.67 arc45 25.46,26.6 R13.1
  Top 0.61: Q4.3 28.05,27.94 | 27.87,27.87 26.67,26.67 25.64,26.67 | v24.13,24.77 24.77,24.77 25.4,25.4 R13.1
  Bottom 0.61: U1.8 23.5,25.4 v24.13,24.77
XB-SLEEP3V  (via drill 0.51)
  Top 0.305: 35.01,28.89 arc45 35.18,28.96 R12.1 | 29.95,29.21 arc-45 29.77,29.28 | 15.88,28.47 arc-45 15.95,28.65 | 17.52,29.21 arc45 17.7,29.28 | 35.56,30.38 arc45 35.49,30.55
  Top 0.406: 45.09,53.87 arc45 45.01,54.05 | 29.95,29.21 31.26,29.21 Q4.2
  Top 0.61: Q4.2 35.01,28.89 | 29.77,29.28 v28.57,30.48 | v15.88,27.94 15.88,28.47 | 15.95,28.65 16.51,29.21 17.52,29.21 | 17.7,29.28 XBEE1.13 | R12.1 35.56,30.38 | 35.49,30.55 v34.29,31.75 | 45.09,53.87 45.09,48.9 41.91,45.72 41.91,43.18 39.37,40.64 39.37,35.56 38.1,34.29 v36.2,34.29 36.27,34.36 | 45.01,54.05 43.81,55.24 43.27,55.24 XBEE.13
  Bottom 0.305: 17.25,26.67 arc-45 17.07,26.74 | 34.29,32.28 arc-45 34.36,32.46
  Bottom 0.61: 17.25,26.67 24.77,26.67 v28.57,30.48 | 17.07,26.74 v15.88,27.94 | v34.29,31.75 34.29,32.28 | 34.36,32.46 v36.2,34.29
XB-SS  (via drill 0.51)
  Top 0.406: R1.1 35.05,57.91 v36.2,59.05 | v40.64,63.5 42.95,63.5 XBEE.17
  Top 0.61: Q1.2 33.84,57.47 R1.1
  Bottom 0.406: v36.2,59.05 36.83,59.05 40.01,62.23 40.01,62.87 v40.64,63.5

### Text on the board
bPlace: UART | UART | SPI | SPI
tNames: ASSO | RSSI | - | ~ | + | - | ~ | + | - | CL | DA | + | - | CL | DA | + | + | - | CL | DA | TEMP | - | ~ | + | - | ~ | + | - | ~ | + | - | ~ | + | - | ~ | + | + | + | 5V In | LED | GND | ASSO | + | RSSI | + | - | 12V IN
bNames: SCL | SDA | Karl Mohring | 2016-05-19